# EAGLE schematic driver_MC33887PFK (EAGLE 7.6.0)
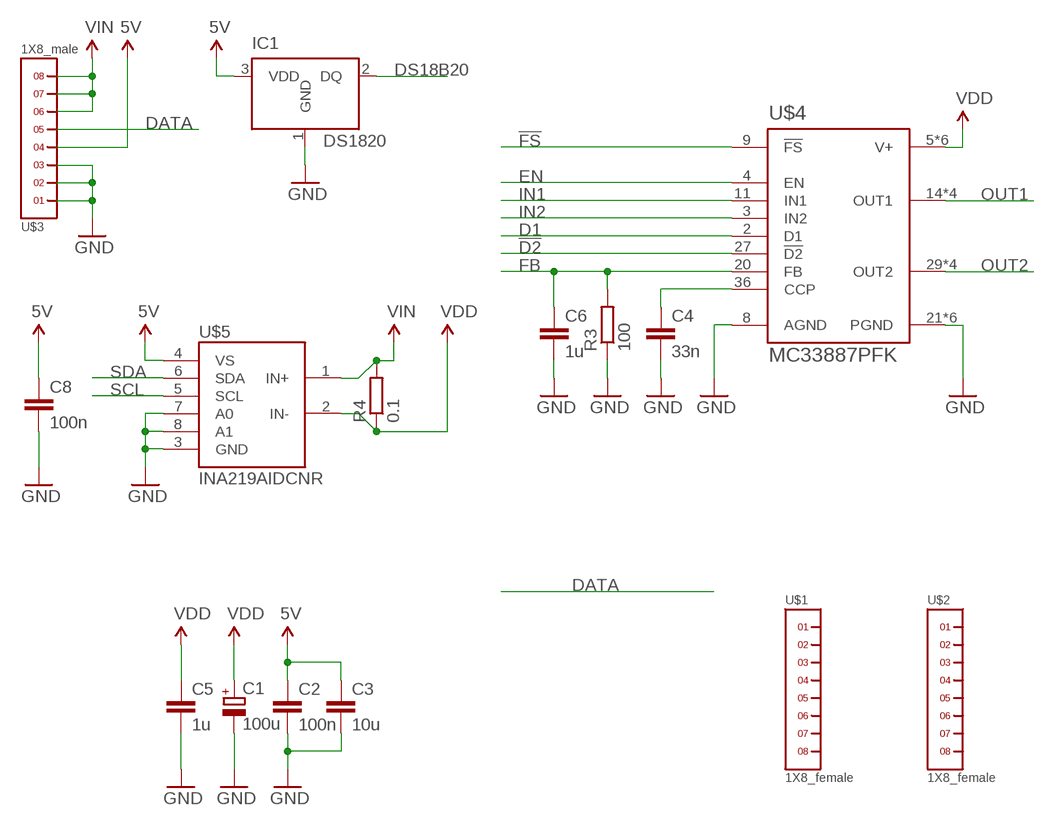
[diagram p0: schematic, sheet 1]

## Parts
C1  100u  CPOL-EUD  [PANASONIC_D]
C2  100n  C-EUC0402K  [C0402K]
C3  10u  C-EUC0603K  [C0603K]
C4  33n  C-EUC0402K  [C0402K]
C5  1u  C-EUC0402K  [C0402K]
C6  1u  C-EUC0402K  [C0402K]
C8  100n  C-EUC0402K  [C0402K]
IC1  DS1820  [TO-92]
R3  100  R-EU_R0402  [R0402]
R4  0.1  R-EU_R0603  [R0603]
U$1  1X8_female  1X8  [1X8]
U$2  1X8_female  1X8  [1X8]
U$3  1X8_male  1X8MALE  [1X8_MALE]
U$4  MC33887PFK  MC33887  [QFN32]
U$5  INA219AIDCNR  [SOT23-8L]

## Nets
5V: C2.1 C3.1 C8.1 IC1.3(VDD) U$3.4 U$5.4(VS)
!D2: U$4.27(!D2)
!FS: U$4.9(!FS)
D1: U$4.2(D1)
DATA: U$3.5
DS18B20: IC1.2(DQ)
EN: U$4.4(EN)
FB: C6.1 R3.2 U$4.20(FB)
GND: C1.- C2.2 C3.2 C4.2 C5.2 C6.2 C8.2 IC1.1(GND) R3.1 U$3.1 U$3.2 U$3.3 U$4.8(AGND) U$4.21(PGND) U$4.22(PGND) U$4.23(PGND) U$4.24(PGND) U$4.25(PGND) U$4.26(PGND) U$5.3(GND) U$5.7(A0) U$5.8(A1)
IN1: U$4.11(IN1)
IN2: U$4.3(IN2)
N$1: C4.1 U$4.36(CCP)
OUT1: U$4.14(OUT1) U$4.15(OUT1) U$4.17(OUT1) U$4.18(OUT1)
OUT2: U$4.29(OUT2) U$4.30(OUT2) U$4.32(OUT2) U$4.33(OUT2)
SCL: U$5.5(SCL)
SDA: U$5.6(SDA)
VDD: C1.+ C5.1 R4.1 U$4.5(V+) U$4.6(V+) U$4.12(V+) U$4.13(V+) U$4.34(V+) U$4.35(V+) U$5.2(IN-)
VIN: R4.2 U$3.6 U$3.7 U$3.8 U$5.1(IN+)
Unconnected: U$1.1 U$1.2 U$1.3 U$1.4 U$1.5 U$1.6 U$1.7 U$1.8 U$2.1 U$2.2 U$2.3 U$2.4 U$2.5 U$2.6 U$2.7 U$2.8

## Library data of the parts
C1 = rcl:CPOL-EU: POLARIZED CAPACITOR, European symbol
C2-C6 C8 = rcl:C-EU: CAPACITOR, European symbol
IC1 = DS1820:DS1820: DS1820 - 1-Wire Digital Thermometer
R3 R4 = rcl:R-EU_: RESISTOR, European symbol
U$1-U$3 = headers(.05in):1X8
U$4 = MC33887PFK:MC33887
U$5 = INA219AIDCNR:INA219AIDCNR